# EasyEDA schematic Rectenna.json
TITLE: New Schematic; REV: 1.0; Date: 2018-12-02; Sheet: 1/1; Drawn By: Your Name
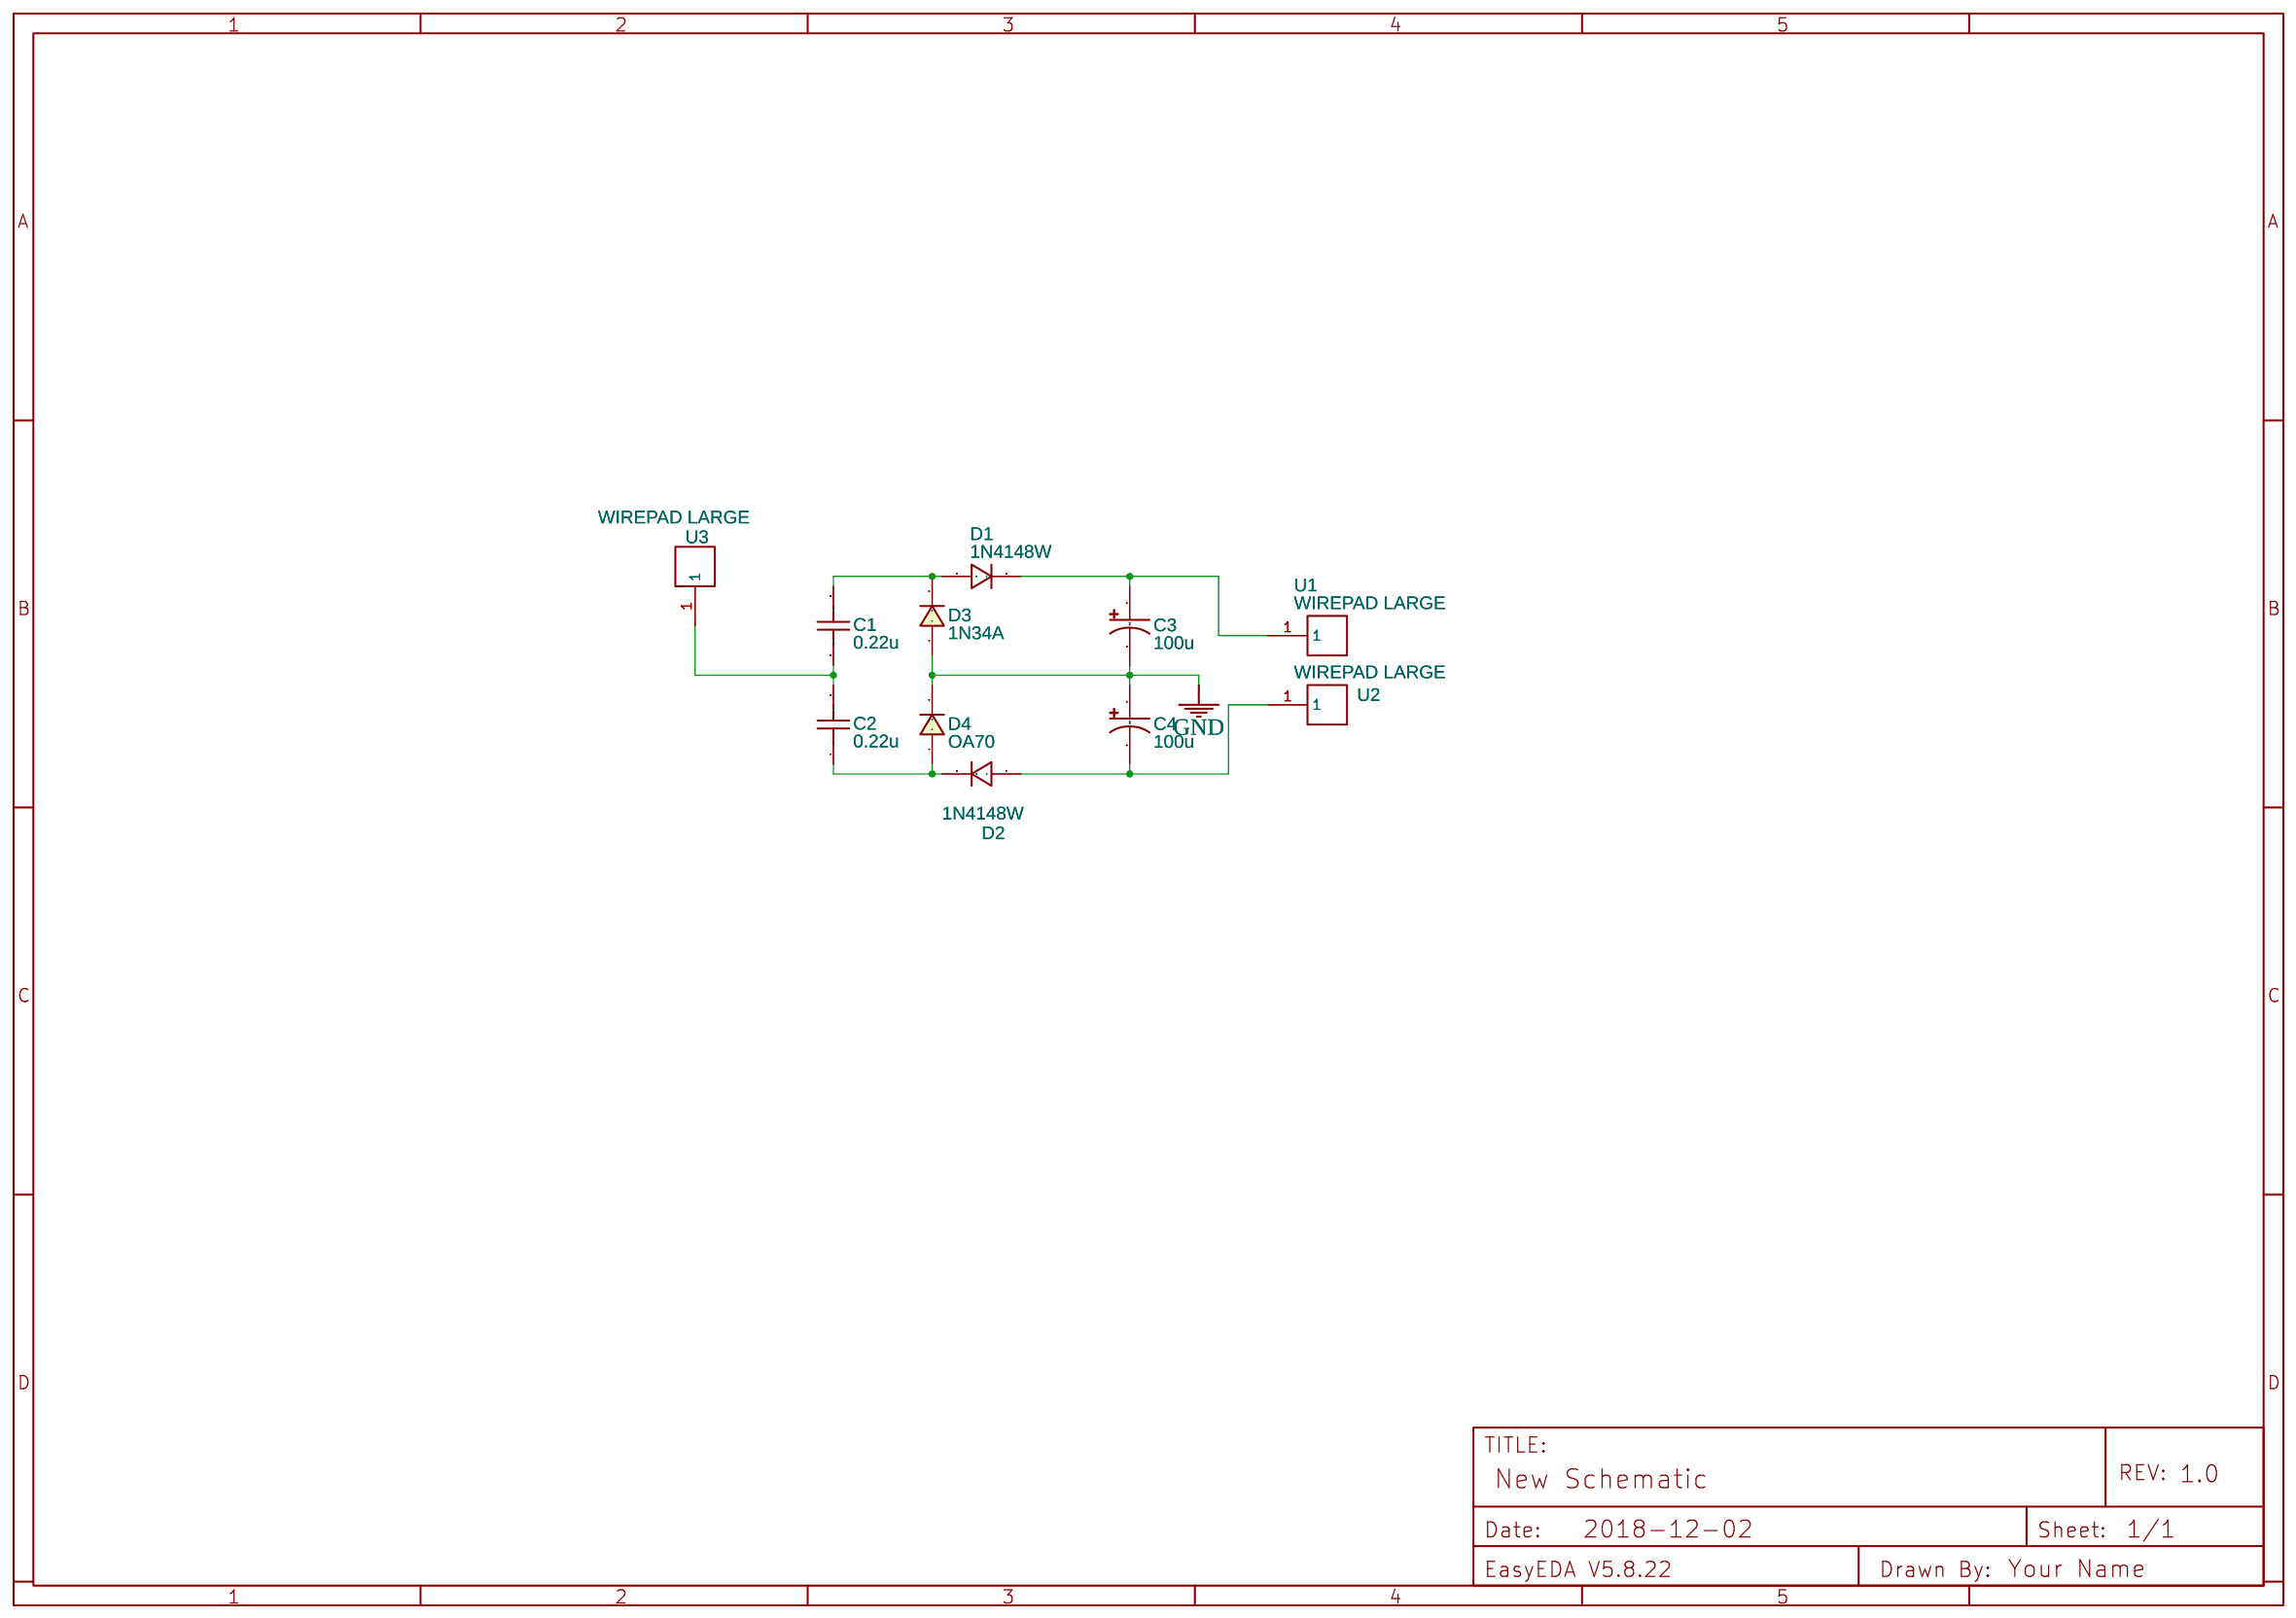
[diagram p0: schematic sheet]

## Parts
C1  0.22u  [RAD-0.1]
C2  0.22u  [RAD-0.1]
C3  100u  [CAP-D3.0XF1.5]
C4  100u  [CAP-D3.0XF1.5]
D1  1N4148W  [CAP-3.5*7.5*7.2]
D2  1N4148W  [CAP-3.5*7.5*7.2]
D3  1N34A  [DO-7]
D4  OA70  [DO-7]
U1  WIREPAD LARGE  [WIRE PAD LARGE]
U2  WIREPAD LARGE  [WIRE PAD LARGE]
U3  WIREPAD LARGE  [WIRE PAD LARGE]

## Library data of the parts
C1 C2 = Cap_RAD-0.1_US: Manufacturer Part: ?
C3 C4 = Cap_Electrolytic(TH)_D3.0XF1.5_US: Manufacturer Part: ?
D1 D2 = -: Supplier Part: C81598; Supplier: LCSC; Manufacturer: SEMTECH; image: //image.lceda.cn/szlcsc/C81598.jpg
D3 = -: Contributor: opopnevermind
D4 = -: Manufacturer Part: 1N34A; Contributor: opopnevermind
U1-U3 = -: Contributor: Alex1987

## Nets
GND: C3.2 C4.1 D3.1(A) D4.2(K)
C1_1: C1.1 C2.2 U3.1
C1_2: C1.2 D1.1(A) D3.2(K)
C2_1: C2.1 D2.2(K) D4.1(A)
C3_1: C3.1 D1.2(K) U1.1
C4_2: C4.2 D2.1(A) U2.1
